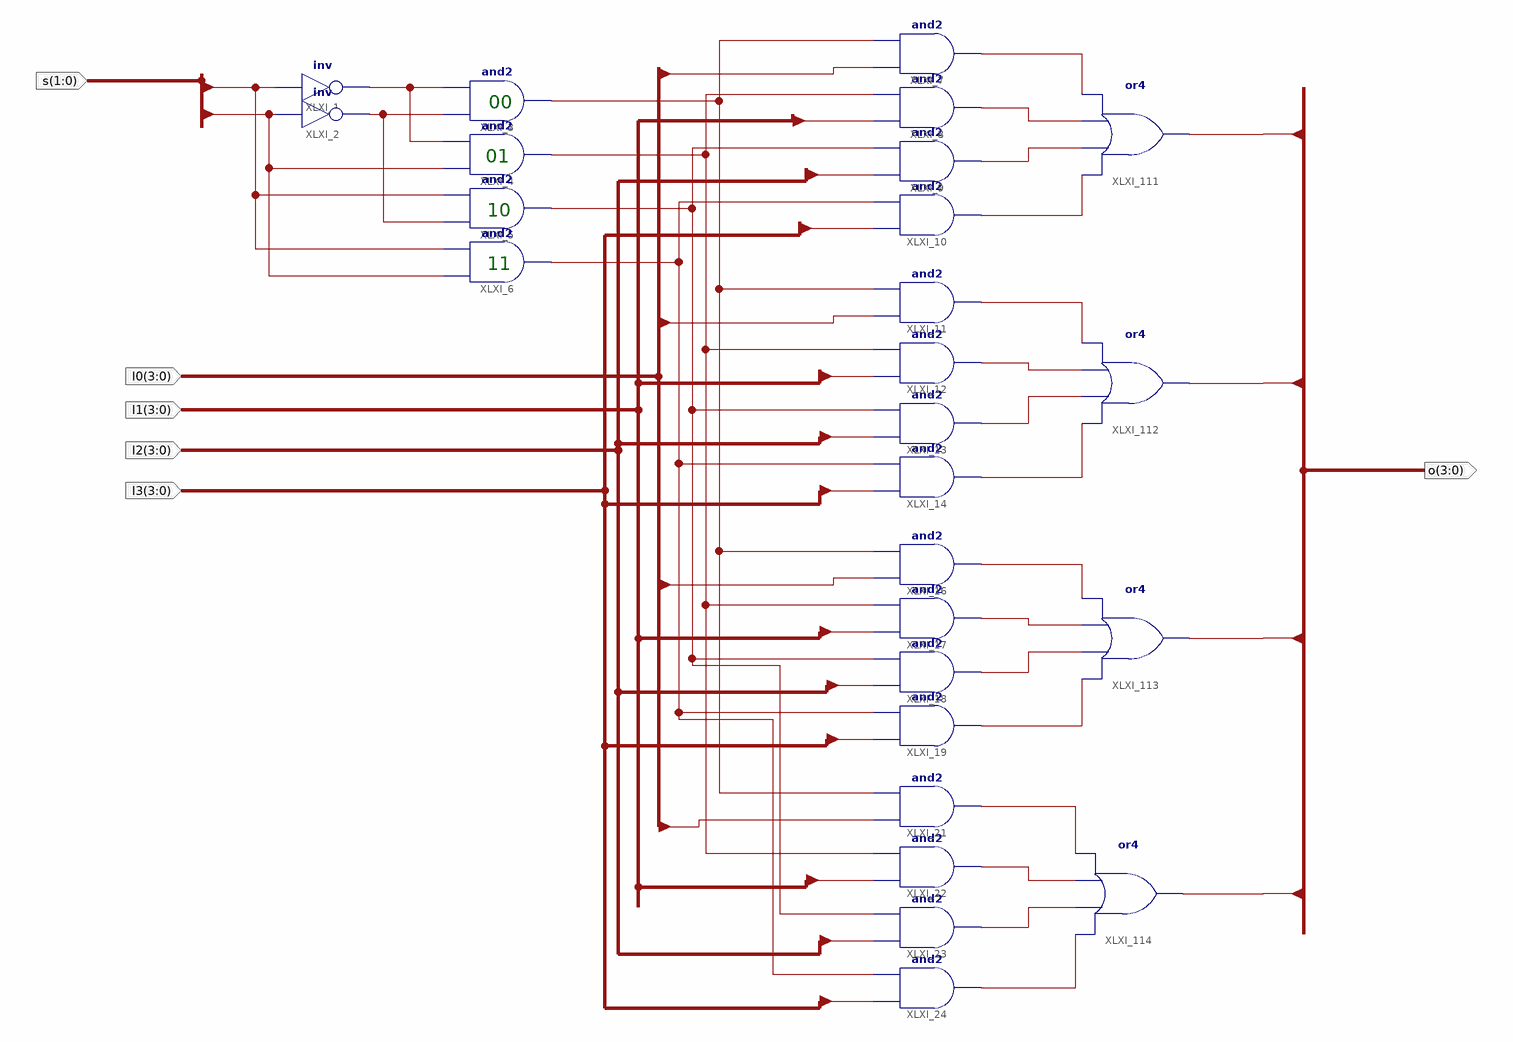
[diagram p0: schematic sheet 1]
// Xilinx ISE schematic Mux4to1b4.sch (artix7) as structural Verilog: 26 symbols, 6 ports
module Mux4to1b4 (
  input  [1:0] s,
  input  [3:0] l0,
  input  [3:0] l1,
  input  [3:0] l2,
  input  [3:0] l3,
  output [3:0] o
);

  wire XLXN_4, XLXN_5, XLXN_6, XLXN_7, XLXN_8, XLXN_9, XLXN_129, XLXN_130, XLXN_131, XLXN_132, XLXN_133,
       XLXN_134, XLXN_135, XLXN_136, XLXN_137, XLXN_138, XLXN_139, XLXN_140, XLXN_141, XLXN_142, XLXN_143,
       XLXN_144;

  not XLXI_1 (XLXN_4, s[1]);
  not XLXI_2 (XLXN_5, s[0]);
  and XLXI_3 (XLXN_6, XLXN_5, XLXN_4);
  and XLXI_4 (XLXN_7, s[0], XLXN_4);
  and XLXI_5 (XLXN_8, XLXN_5, s[1]);
  and XLXI_6 (XLXN_9, s[0], s[1]);
  and XLXI_24 (XLXN_144, l3[3], XLXN_9);
  and XLXI_23 (XLXN_143, l2[3], XLXN_8);
  and XLXI_22 (XLXN_142, l1[3], XLXN_7);
  and XLXI_21 (XLXN_141, l0[3], XLXN_6);
  and XLXI_19 (XLXN_140, l3[2], XLXN_9);
  and XLXI_18 (XLXN_139, l2[2], XLXN_8);
  and XLXI_17 (XLXN_138, l1[2], XLXN_7);
  and XLXI_16 (XLXN_137, l0[2], XLXN_6);
  and XLXI_14 (XLXN_136, l3[1], XLXN_9);
  and XLXI_13 (XLXN_135, l2[1], XLXN_8);
  and XLXI_12 (XLXN_134, l1[1], XLXN_7);
  and XLXI_11 (XLXN_133, l0[1], XLXN_6);
  and XLXI_10 (XLXN_132, l3[0], XLXN_9);
  and XLXI_9 (XLXN_131, l2[0], XLXN_8);
  and XLXI_8 (XLXN_130, l1[0], XLXN_7);
  and XLXI_7 (XLXN_129, l0[0], XLXN_6);
  or XLXI_111 (o[0], XLXN_132, XLXN_131, XLXN_130, XLXN_129);
  or XLXI_112 (o[1], XLXN_136, XLXN_135, XLXN_134, XLXN_133);
  or XLXI_113 (o[2], XLXN_140, XLXN_139, XLXN_138, XLXN_137);
  or XLXI_114 (o[3], XLXN_144, XLXN_143, XLXN_142, XLXN_141);

  // Notes on the sheet:
  //   00
  //   01
  //   10
  //   11
endmodule
